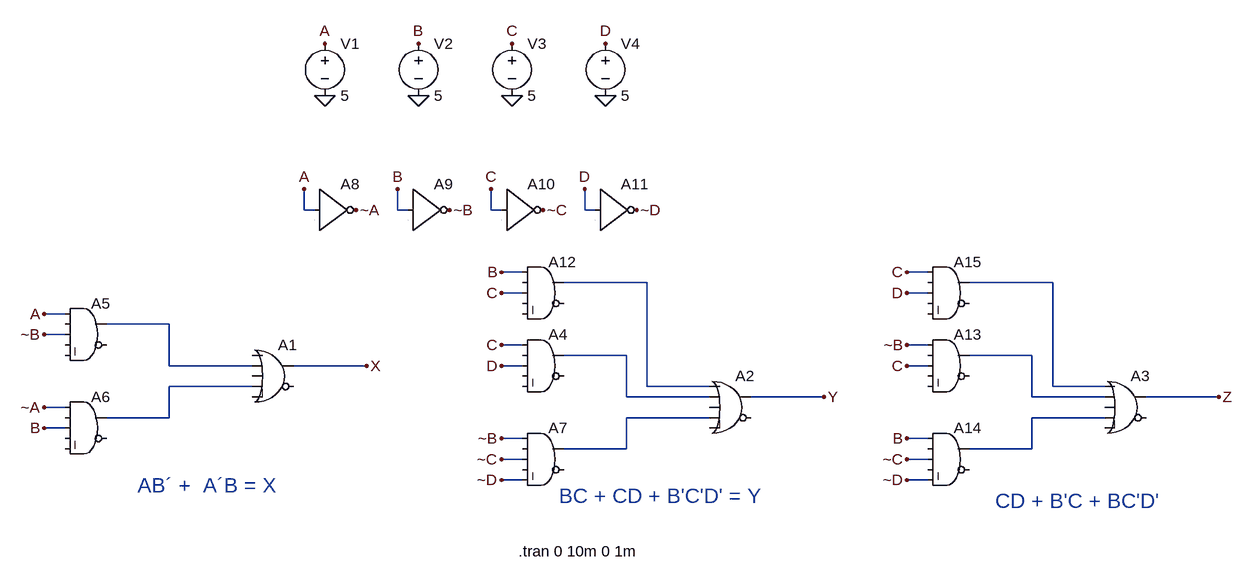
[diagram p0: schematic Inlämning 1.asc]
Inlämning 1.asc, the LTspice schematic file:
Version 4
SHEET 1 1312 864
WIRE -128 -64 -128 -96
WIRE -112 -64 -128 -64
WIRE 16 -64 16 -96
WIRE 32 -64 16 -64
WIRE 160 -64 160 -96
WIRE 176 -64 160 -64
WIRE 304 -64 304 -96
WIRE 320 -64 304 -64
WIRE 208 32 176 32
WIRE 832 32 800 32
WIRE 400 48 272 48
WIRE 1024 48 896 48
WIRE 208 64 176 64
WIRE 832 64 800 64
WIRE -496 96 -528 96
WIRE -336 112 -432 112
WIRE -496 128 -528 128
WIRE 208 144 176 144
WIRE 832 144 800 144
WIRE 368 160 272 160
WIRE 992 160 896 160
WIRE -336 176 -336 112
WIRE -208 176 -336 176
WIRE -32 176 -144 176
WIRE 208 176 176 176
WIRE 832 176 800 176
WIRE -208 208 -336 208
WIRE 400 208 400 48
WIRE 496 208 400 208
WIRE 1024 208 1024 48
WIRE 1104 208 1024 208
WIRE 368 224 368 160
WIRE 496 224 368 224
WIRE 672 224 560 224
WIRE 992 224 992 160
WIRE 1104 224 992 224
WIRE 1280 224 1168 224
WIRE -496 240 -528 240
WIRE -336 256 -336 208
WIRE -336 256 -432 256
WIRE 496 256 368 256
WIRE 1104 256 992 256
WIRE -496 272 -528 272
WIRE 208 288 176 288
WIRE 832 288 800 288
WIRE 368 304 368 256
WIRE 368 304 272 304
WIRE 992 304 992 256
WIRE 992 304 896 304
WIRE 208 320 176 320
WIRE 832 320 800 320
WIRE 208 352 176 352
WIRE 832 352 800 352
FLAG -96 -240 0
FLAG 48 -240 0
FLAG 192 -240 0
FLAG 336 -240 0
FLAG -96 -320 A
FLAG 48 -320 B
FLAG 192 -320 C
FLAG 336 -320 D
FLAG -32 176 X
FLAG 672 224 Y
FLAG 1280 224 Z
FLAG 304 -96 D
FLAG 160 -96 C
FLAG 16 -96 B
FLAG -128 -96 A
FLAG -48 -64 ~A
FLAG 96 -64 ~B
FLAG 240 -64 ~C
FLAG 384 -64 ~D
FLAG -528 128 ~B
FLAG -528 240 ~A
FLAG -528 272 B
FLAG -528 96 A
FLAG 176 176 D
FLAG 176 288 ~B
FLAG 176 320 ~C
FLAG 176 144 C
FLAG 176 64 C
FLAG 176 32 B
FLAG 176 352 ~D
FLAG 800 176 C
FLAG 800 288 B
FLAG 800 320 ~C
FLAG 800 144 ~B
FLAG 800 64 D
FLAG 800 32 C
FLAG 800 352 ~D
SYMBOL voltage -96 -336 R0
WINDOW 123 0 0 Left 0
WINDOW 39 0 0 Left 0
SYMATTR InstName V1
SYMATTR Value 5
SYMBOL voltage 48 -336 R0
SYMATTR InstName V2
SYMATTR Value 5
SYMBOL voltage 192 -336 R0
WINDOW 123 0 0 Left 0
WINDOW 39 0 0 Left 0
SYMATTR InstName V3
SYMATTR Value 5
SYMBOL voltage 336 -336 R0
SYMATTR InstName V4
SYMATTR Value 5
SYMBOL Digital\\or -176 128 R0
SYMATTR InstName A1
SYMATTR SpiceLine vhigh = 5
SYMBOL Digital\\or 528 176 R0
SYMATTR InstName A2
SYMATTR SpiceLine vhigh = 5
SYMBOL Digital\\or 1136 176 R0
SYMATTR InstName A3
SYMATTR SpiceLine vhigh = 5
SYMBOL Digital\\and -464 64 R0
SYMATTR InstName A5
SYMATTR SpiceLine vhigh = 5
SYMBOL Digital\\and -464 208 R0
SYMATTR InstName A6
SYMATTR SpiceLine vhigh = 5
SYMBOL Digital\\inv -112 -128 R0
SYMATTR InstName A8
SYMATTR SpiceLine vhigh = 5
SYMBOL Digital\\inv 32 -128 R0
SYMATTR InstName A9
SYMATTR SpiceLine vhigh = 5
SYMBOL Digital\\inv 176 -128 R0
SYMATTR InstName A10
SYMATTR SpiceLine vhigh = 5
SYMBOL Digital\\inv 320 -128 R0
SYMATTR InstName A11
SYMATTR SpiceLine vhigh = 5
SYMBOL Digital\\and 240 112 R0
SYMATTR InstName A4
SYMATTR SpiceLine vhigh = 5
SYMBOL Digital\\and 240 256 R0
SYMATTR InstName A7
SYMATTR SpiceLine vhigh = 5
SYMBOL Digital\\and 240 0 R0
SYMATTR InstName A12
SYMATTR SpiceLine vhigh = 5
SYMBOL Digital\\and 864 112 R0
SYMATTR InstName A13
SYMATTR SpiceLine vhigh = 5
SYMBOL Digital\\and 864 256 R0
SYMATTR InstName A14
SYMATTR SpiceLine vhigh = 5
SYMBOL Digital\\and 864 0 R0
SYMATTR InstName A15
SYMATTR SpiceLine vhigh = 5
TEXT 202 462 Left 2 !.tran 0 10m 0 1m
TEXT -384 360 Left 3 ;AB´ +  A´B = X
TEXT 264 376 Left 3 ;BC + CD + B'C'D' = Y
TEXT 936 384 Left 3 ;CD + B'C + BC'D'

The netlist it stands for:
* Inlämning 1.asc
V1 A 0 5
V2 B 0 5
V3 C 0 5
V4 D 0 5
A1 0 N003 0 N006 0 0 X 0 OR vhigh = 5
A2 N001 N004 0 N007 0 0 Y 0 OR vhigh = 5
A3 N002 N005 0 N008 0 0 Z 0 OR vhigh = 5
A5 A 0 ~B 0 0 0 N003 0 AND vhigh = 5
A6 ~A 0 B 0 0 0 N006 0 AND vhigh = 5
A8 A 0 0 0 0 ~A 0 0 BUF vhigh = 5
A9 B 0 0 0 0 ~B 0 0 BUF vhigh = 5
A10 C 0 0 0 0 ~C 0 0 BUF vhigh = 5
A11 D 0 0 0 0 ~D 0 0 BUF vhigh = 5
A4 C 0 D 0 0 0 N004 0 AND vhigh = 5
A7 ~B 0 ~C 0 ~D 0 N007 0 AND vhigh = 5
A12 B 0 C 0 0 0 N001 0 AND vhigh = 5
A13 ~B 0 C 0 0 0 N005 0 AND vhigh = 5
A14 B 0 ~C 0 ~D 0 N008 0 AND vhigh = 5
A15 C 0 D 0 0 0 N002 0 AND vhigh = 5
.tran 0 10m 0 1m
* AB´ +  A´B = X
* BC + CD + B'C'D' = Y
* CD + B'C + BC'D'
.backanno
.end